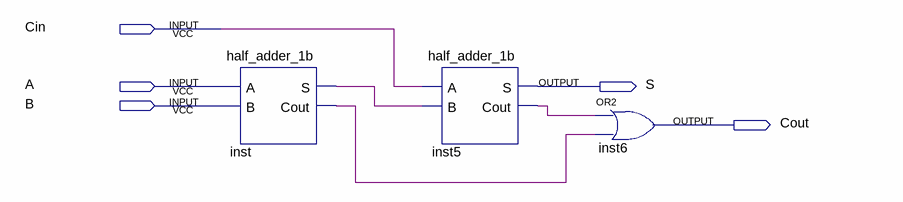
[diagram p0: schematic sheet]
// Quartus schematic full_adder_1b_ha.bdf as structural Verilog: 3 symbols, 5 pins
module full_adder_1b_ha (
  input  Cin,
  input  A,
  input  B,
  output S,
  output Cout
);

  wire inst5_cout, inst_cout, inst_s;

  half_adder_1b inst (.A(A), .B(B), .S(inst_s), .Cout(inst_cout));
  half_adder_1b inst5 (.A(Cin), .B(inst_s), .S(S), .Cout(inst5_cout));
  or inst6 (Cout, inst5_cout, inst_cout);
endmodule
